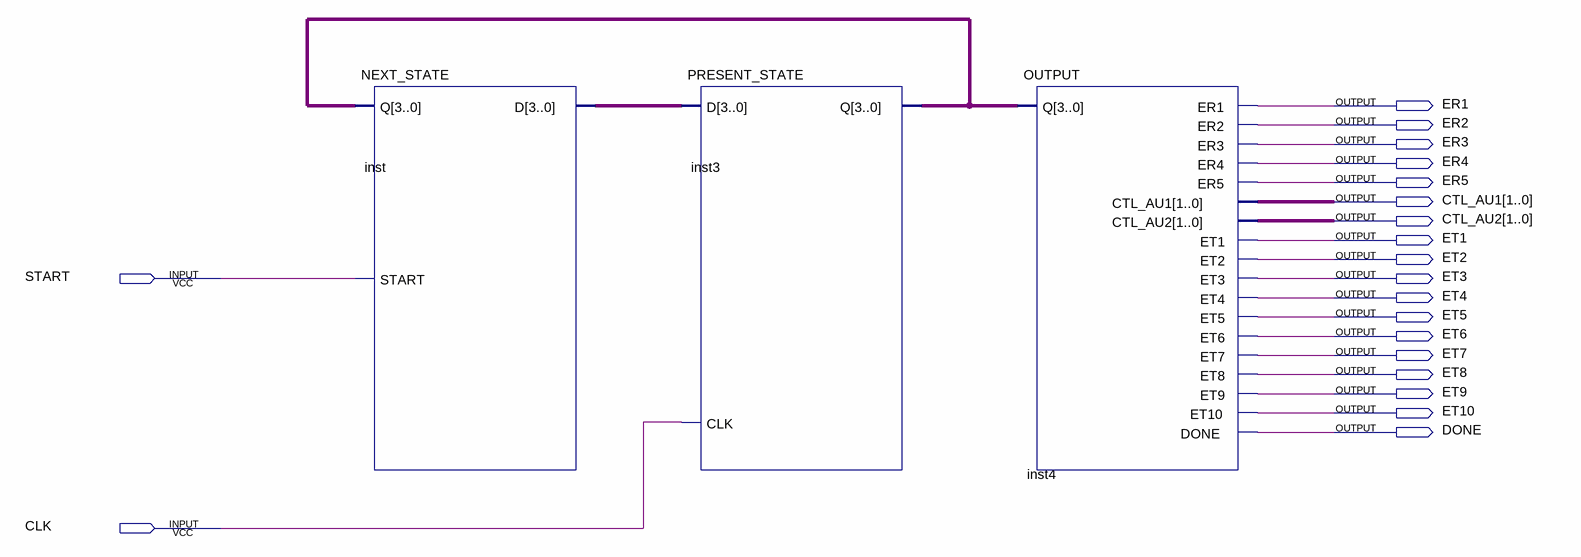
[diagram p0: schematic sheet]
// Quartus schematic Piplined_AU_Datapath_CONTROLLER.bdf as structural Verilog: 3 symbols, 20 pins
module Piplined_AU_Datapath_CONTROLLER (
  input  START,
  input  CLK,
  output ER1,
  output ER2,
  output ER3,
  output ER4,
  output ER5,
  output [1:0] CTL_AU1,
  output [1:0] CTL_AU2,
  output ET1,
  output ET2,
  output ET3,
  output ET4,
  output ET5,
  output ET6,
  output ET7,
  output ET8,
  output ET9,
  output ET10,
  output DONE
);

  wire [3:0] inst3_q, inst_d;

  NEXT_STATE inst (.START(START), .Q(inst3_q), .D(inst_d));
  PRESENT_STATE inst3 (.CLK(CLK), .D(inst_d), .Q(inst3_q));
  OUTPUT inst4 (
    .Q(inst3_q), .ER1(ER1), .ER2(ER2), .ER3(ER3), .ER4(ER4), .ER5(ER5), .CTL_AU1(CTL_AU1), .CTL_AU2(CTL_AU2),
    .ET1(ET1), .ET2(ET2), .ET3(ET3), .ET4(ET4), .ET5(ET5), .ET6(ET6), .ET7(ET7), .ET8(ET8), .ET9(ET9),
    .ET10(ET10), .DONE(DONE));
endmodule
